# EAGLE schematic wakeup (EAGLE 7.7.0)
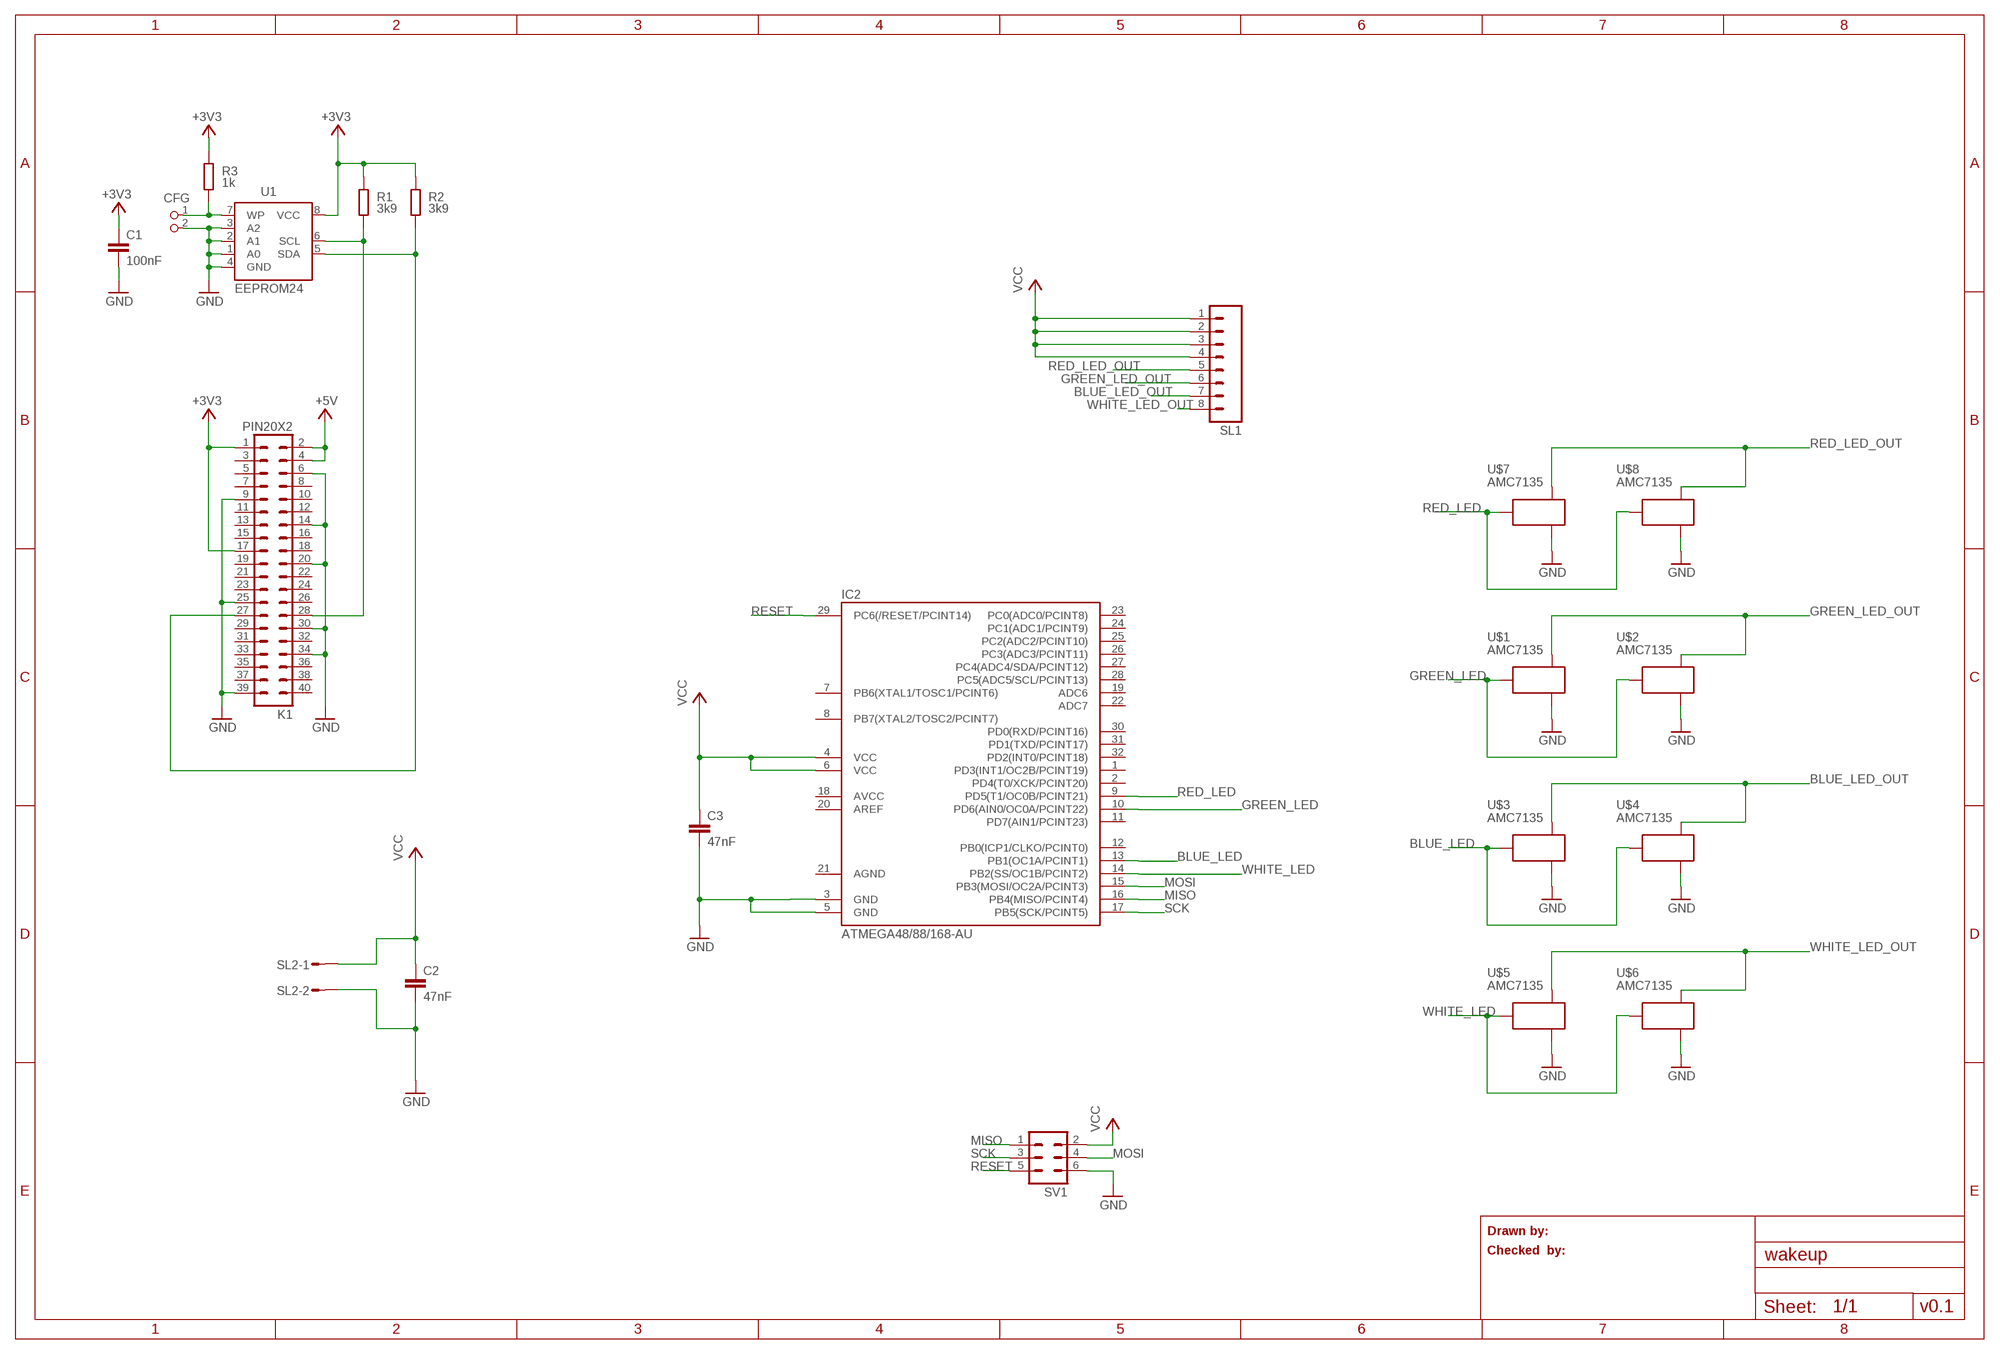
[diagram p0: schematic, sheet 1]

## Parts
C1  100nF  C-EUC0805K  [C0805K]
C2  47nF  C-EUC0805  [C0805]
C3  47nF  C-EUC0805  [C0805]
CFG  PIN2_100  [PIN_W_2]
IC2  ATMEGA48/88/168-AU  [TQFP32-08]
K1  PIN20X2  [PIN_20X2]
R1  3k9  R-EU_M0805  [M0805]
R2  3k9  R-EU_M0805  [M0805]
R3  1k  R-EU_M0805  [M0805]
SL1  M08  [08P]
SL2  M02S  [02P]
SV1  ML6  [ML6]
U1  EEPROM24  [SOIC8]
U$1  AMC7135  [SOT]
U$2  AMC7135  [SOT]
U$3  AMC7135  [SOT]
U$4  AMC7135  [SOT]
U$5  AMC7135  [SOT]
U$6  AMC7135  [SOT]
U$7  AMC7135  [SOT]
U$8  AMC7135  [SOT]

## Nets
+3V3: C1.1 K1.1 K1.17 R1.2 R2.2 R3.2 U1.8(VCC)
+5V: K1.2 K1.4
BLUE_LED: IC2.13(PB1(OC1A/PCINT1)) U$3.3(VDD) U$4.3(VDD)
BLUE_LED_OUT: SL1.7 U$3.1(OUT) U$4.1(OUT)
GND: C1.2 C2.2 C3.2 CFG.2 IC2.3(GND) IC2.5(GND) K1.6 K1.9 K1.14 K1.20 K1.25 K1.30 K1.34 K1.39 SL2.2 SV1.6 U1.1(A0) U1.2(A1) U1.3(A2) U1.4(GND) U$1.2(GND) U$1.2@1(GND) U$2.2(GND) U$2.2@1(GND) U$3.2(GND) U$3.2@1(GND) U$4.2(GND) U$4.2@1(GND) U$5.2(GND) U$5.2@1(GND) U$6.2(GND) U$6.2@1(GND) U$7.2(GND) U$7.2@1(GND) U$8.2(GND) U$8.2@1(GND)
GREEN_LED: IC2.10(PD6(AIN0/OC0A/PCINT22)) U$1.3(VDD) U$2.3(VDD)
GREEN_LED_OUT: SL1.6 U$1.1(OUT) U$2.1(OUT)
MISO: IC2.16(PB4(MISO/PCINT4)) SV1.1
MOSI: IC2.15(PB3(MOSI/OC2A/PCINT3)) SV1.4
N$1: K1.28 R1.1 U1.6(SCL)
N$2: K1.27 R2.1 U1.5(SDA)
N$3: CFG.1 R3.1 U1.7(WP)
RED_LED: IC2.9(PD5(T1/OC0B/PCINT21)) U$7.3(VDD) U$8.3(VDD)
RED_LED_OUT: SL1.5 U$7.1(OUT) U$8.1(OUT)
RESET: IC2.29(PC6(/RESET/PCINT14)) SV1.5
SCK: IC2.17(PB5(SCK/PCINT5)) SV1.3
VCC: C2.1 C3.1 IC2.4(VCC) IC2.6(VCC) SL1.1 SL1.2 SL1.3 SL1.4 SL2.1 SV1.2
WHITE_LED: IC2.14(PB2(SS/OC1B/PCINT2)) U$5.3(VDD) U$6.3(VDD)
WHITE_LED_OUT: SL1.8 U$5.1(OUT) U$6.1(OUT)
Unconnected: IC2.1(PD3(INT1/OC2B/PCINT19)) IC2.2(PD4(T0/XCK/PCINT20)) IC2.7(PB6(XTAL1/TOSC1/PCINT6)) IC2.8(PB7(XTAL2/TOSC2/PCINT7)) IC2.11(PD7(AIN1/PCINT23)) IC2.12(PB0(ICP1/CLKO/PCINT0)) IC2.18(AVCC) IC2.19(ADC6) IC2.20(AREF) IC2.22(ADC7) IC2.23(PC0(ADC0/PCINT8)) IC2.24(PC1(ADC1/PCINT9)) IC2.25(PC2(ADC2/PCINT10)) IC2.26(PC3(ADC3/PCINT11)) IC2.27(PC4(ADC4/SDA/PCINT12)) IC2.28(PC5(ADC5/SCL/PCINT13)) IC2.30(PD0(RXD/PCINT16)) IC2.31(PD1(TXD/PCINT17)) IC2.32(PD2(INT0/PCINT18)) K1.3 K1.5 K1.7 K1.8 K1.10 K1.11 K1.12 K1.13 K1.15 K1.16 K1.18 K1.19 K1.21 K1.22 K1.23 K1.24 K1.26 K1.29 K1.31 K1.32 K1.33 K1.35 K1.36 K1.37 K1.38 K1.40

## Notes on the sheet
- Drawn by:
- Checked  by:
- v0.1

## Power pins joined to a net without a drawn wire
AGND: IC2.21(AGND)

## Library data of the parts
C1 = resistor:C-EU: CAPACITOR, European symbol; DIELECTRIC: X7R
C2 C3 = rcl:C-EU: CAPACITOR, European symbol
CFG = FLYFISH:PIN2
IC2 = atmega8:ATMEGA48/88/168
K1 = FLYFISH:PIN20X2
R1-R3 = resistor:R-EU_: RESISTOR, European symbol; TOLERANCE: 5%
SL1 = con-amp-quick:M08: AMP QUICK CONNECTOR; OC_FARNELL: unknown; OC_NEWARK: unknown
SL2 = con-amp-quick:M02S: AMP QUICK CONNECTOR; OC_FARNELL: unknown; OC_NEWARK: unknown
SV1 = con-ml:ML6: HARTING; OC_FARNELL: unknown; OC_NEWARK: unknown
U1 = FLYFISH:EEPROM24
U$1-U$8 = 1:AMC7135: Spannungsregler AMC7135 http://www.micro-bridge.com/data/add/amc7135.pdf